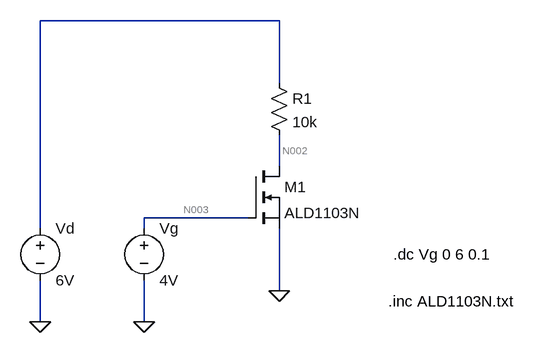
[diagram p0: schematic Exp4 - NMOS.asc]
Exp4 - NMOS.asc, the LTspice schematic file:
Version 4.1
SHEET 1 880 680
WIRE 192 -144 -176 -144
WIRE 192 -48 192 -144
WIRE 192 80 192 32
WIRE 144 160 -16 160
WIRE -176 176 -176 -144
WIRE -16 176 -16 160
WIRE 192 272 192 176
WIRE -176 320 -176 256
WIRE -16 320 -16 256
FLAG 192 272 0
FLAG -176 320 0
FLAG -16 320 0
SYMBOL nmos 144 80 R0
SYMATTR InstName M1
SYMATTR Value ALD1103N
SYMBOL voltage -16 160 R0
WINDOW 123 0 0 Left 0
WINDOW 39 0 0 Left 0
SYMATTR InstName Vg
SYMATTR Value 4V
SYMBOL voltage -176 160 R0
SYMATTR InstName Vd
SYMATTR Value 6V
SYMBOL res 176 -64 R0
SYMATTR InstName R1
SYMATTR Value 10k
TEXT 360 288 Left 2 !.inc ALD1103N.txt
TEXT 368 216 Left 2 !.dc Vg 0 6 0.1

The netlist it stands for:
* Exp4 - NMOS.asc
M1 N002 N003 0 0 ALD1103N
Vg N003 0 4V
Vd N001 0 6V
R1 N001 N002 10k
.model NMOS NMOS
.model PMOS PMOS
.lib standard.mos
.inc ALD1103N.txt
.dc Vg 0 6 0.1
.backanno
.end

* Results of the author's LTspice run, read from the files saved beside the schematic
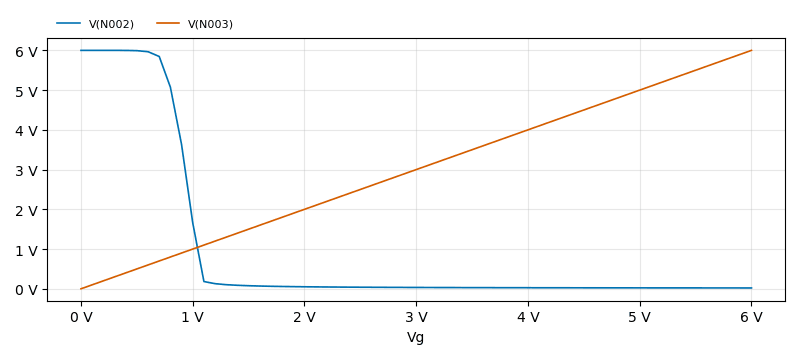
[diagram p1: DC transfer characteristic of Exp4 - NMOS.asc, plotted from the saved traces]
* DC transfer characteristic, 1 run:
*   V(N002): 6 V at Vg=0 V, 21.42 mV at Vg=6 V, min 21.42 mV, max 6 V
*   V(N003): 0 V at Vg=0 V, 6 V at Vg=6 V, min 0 V, max 6 V